# Altium schematic sheet Codec.SchDoc
size A3; SheetNumber: 8; SheetTotal: 13
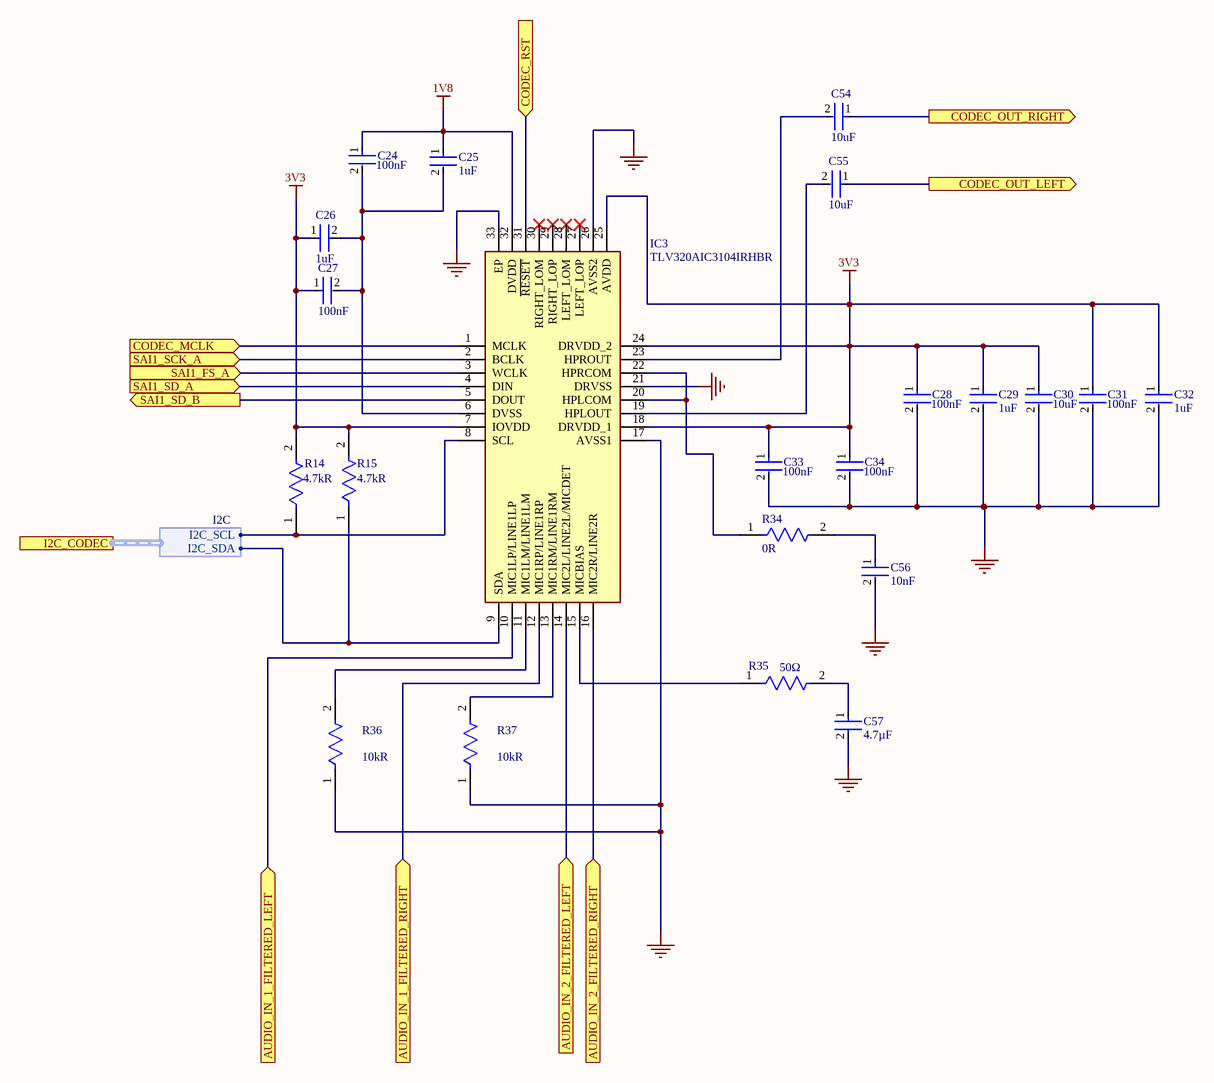
[diagram p0: Codec.SchDoc]

## Parts
C24  Capacitance: 100nF  [FP-GRM033-0_03-IPC_C]  (hidden comment: GRM033C71C104ME14J)
C25  Capacitance: 1uF  [FP-GRM155-0_1-IPC_B]  (hidden comment: GRM155C70J105ME11J)
C26  Capacitance: 1uF  [FP-GRM155-0_1-IPC_B]  (hidden comment: GRM155C70J105ME11J)
C27  Capacitance: 100nF  [FP-GRM033-0_03-IPC_C]  (hidden comment: GRM033C71C104ME14J)
C28  Capacitance: 100nF  [FP-GRM033-0_03-IPC_C]  (hidden comment: GRM033C71C104ME14J)
C29  Capacitance: 1uF  [FP-GRM155-0_1-IPC_B]  (hidden comment: GRM155C70J105ME11J)
C30  Capacitance: 10uF  [FP-GRM21B-0_15-IPC_C]  (hidden comment: GRM21BC81E106KE51K)
C31  Capacitance: 100nF  [FP-GRM033-0_03-IPC_C]  (hidden comment: GRM033C71C104ME14J)
C32  Capacitance: 1uF  [FP-GRM155-0_1-IPC_B]  (hidden comment: GRM155C70J105ME11J)
C33  Capacitance: 100nF  [FP-GRM033-0_03-IPC_C]  (hidden comment: GRM033C71C104ME14J)
C34  Capacitance: 100nF  [FP-GRM033-0_03-IPC_C]  (hidden comment: GRM033C71C104ME14J)
C54  Capacitance: 10uF  [FP-GRM21B-0_15-IPC_C]  (hidden comment: GRM21BC81E106KE51K)
C55  Capacitance: 10uF  [FP-GRM21B-0_15-IPC_C]  (hidden comment: GRM21BC81E106KE51K)
C56  Capacitance: 10nF  [FP-GCM155-0_05-MFG]  (hidden comment: GCM155R71H103KA55W)
C57  Capacitance: 4.7µF  [FP-GCM155-0_2-MFG]  (hidden comment: GCM155D70G475ME36D)
IC3  TLV320AIC3104IRHBR  [TLV320AIC3104IRHBR]
R14  Resistance: 4.7kR  [FP-RC1005-IPC_C]  (hidden comment: RC1005J472CS)
R15  Resistance: 4.7kR  [FP-RC1005-IPC_C]  (hidden comment: RC1005J472CS)
R34  Resistance: 0R  [FP-RMCF0402-MFG]  (hidden comment: RMCF0402ZT0R00)
R35  Resistance: 50Ω  [FP-RC0402-0_4-MFG]  (hidden comment: RC0402JR-0750RL)
R36  Resistance: 10kR  [FP-RC0402-0_4-IPC_A]  (hidden comment: RC0402FR-1310KL)
R37  Resistance: 10kR  [FP-RC0402-0_4-IPC_A]  (hidden comment: RC0402FR-1310KL)

## Ports
AUDIO_IN_1_FILTERED_LEFT (in, see high_level[6B], Input_Output_Filtering[6B]), AUDIO_IN_1_FILTERED_RIGHT (in, see high_level[6B], Input_Output_Filtering[6C]), AUDIO_IN_2_FILTERED_LEFT (in, see high_level[6B], Input_Output_Filtering[6A]), AUDIO_IN_2_FILTERED_RIGHT (in, see high_level[6B], Input_Output_Filtering[6B]), CODEC_MCLK (in, see high_level[5A], MCU_Connections[5B]), CODEC_OUT_LEFT (out, see high_level[6B], Input_Output_Filtering[3C]), CODEC_OUT_RIGHT (out, see high_level[6B], Input_Output_Filtering[3D]), CODEC_RST (in, see high_level[5A], MCU_Connections[5B]), I2C_CODEC (harness I2C, see high_level[5A], MCU_Connections[5B]), SAI1_FS_A (in, see high_level[5A], MCU_Connections[5B]), SAI1_SCK_A (in, see high_level[5A], MCU_Connections[5B]), SAI1_SD_A (in, see high_level[5A], MCU_Connections[5B]), SAI1_SD_B (out, see high_level[5A], MCU_Connections[5B])

## Harnesses
I2C: I2C_SCL, I2C_SDA

## Nets
1V8: C24.1 C25.1 IC3.32(DVDD)
3V3: C26.1 C27.1 C28.1 C29.1 C30.1 C31.1 C32.1 C33.1 C34.1 IC3.7(IOVDD) IC3.18(DRVDD_1) IC3.24(DRVDD_2) IC3.25(AVDD) R14.2 R15.2
GND: C28.2 C29.2 C30.2 C31.2 C32.2 C33.2 C34.2 C56.2 C57.2 IC3.17(AVSS1) IC3.21(DRVSS) IC3.26(AVSS2) IC3.33(EP) R36.1 R37.1
AUDIO_IN_1_FILTERED_LEFT: IC3.10(MIC1LP/LINE1LP) ; port AUDIO_IN_1_FILTERED_LEFT
AUDIO_IN_1_FILTERED_RIGHT: IC3.12(MIC1RP/LINE1RP) ; port AUDIO_IN_1_FILTERED_RIGHT
AUDIO_IN_2_FILTERED_LEFT: IC3.14(MIC2L/LINE2L/MICDET) ; port AUDIO_IN_2_FILTERED_LEFT
AUDIO_IN_2_FILTERED_RIGHT: IC3.16(MIC2R/LINE2R) ; port AUDIO_IN_2_FILTERED_RIGHT
CODEC_MCLK: IC3.1(MCLK) ; port CODEC_MCLK
CODEC_OUT_LEFT: C55.1 ; port CODEC_OUT_LEFT
CODEC_OUT_RIGHT: C54.1 ; port CODEC_OUT_RIGHT
CODEC_RST: IC3.31(~{RESET}) ; port CODEC_RST
SAI1_FS_A: IC3.3(WCLK) ; port SAI1_FS_A
SAI1_SCK_A: IC3.2(BCLK) ; port SAI1_SCK_A
SAI1_SD_A: IC3.4(DIN) ; port SAI1_SD_A
SAI1_SD_B: IC3.5(DOUT) ; port SAI1_SD_B
NetC24_2: C24.2 C25.2 C26.2 C27.2 IC3.6(DVSS)
NetC54_2: C54.2 IC3.23(HPROUT)
NetC55_2: C55.2 IC3.19(HPLOUT)
NetC56_1: C56.1 R34.2
NetC57_1: C57.1 R35.2
NetIC3_8: IC3.8(SCL) R14.1 ; port I2C_CODEC.I2C_SCL
NetIC3_9: IC3.9(SDA) R15.1 ; port I2C_CODEC.I2C_SDA
NetIC3_11: IC3.11(MIC1LM/LINE1LM) R36.2
NetIC3_13: IC3.13(MIC1RM/LINE1RM) R37.2
NetIC3_15: IC3.15(MICBIAS) R35.1
NetIC3_20: IC3.20(HPLCOM) IC3.22(HPRCOM) R34.1

Not connected (* = marked no-connect by the designer): IC3 27(LEFT_LOP)* 28(LEFT_LOM)* 29(RIGHT_LOP)* 30(RIGHT_LOM)*

## Library data of the parts
C24 C27 C28 C31 C33 C34 = CMP-06035-001619-1: Chip Multilayer Ceramic Capacitors for General Purpose, 0201, 0.10uF, X7S, 22%, 20%, 16V; Dielectric: X7S; Tolerance: 20%; Length: 600um; Width: 300um; Voltage Rating (DC): 16V; Thickness: 300um
C25 C26 C29 C32 = CMP-06035-036014-1: Chip Multilayer Ceramic Capacitors for General Purpose, 0402, 1.0uF, X7S, 22%, 20%, 6.3V; Tolerance: 20%; Dielectric: X7S; Length: 1mm; Voltage Rating (DC): 6.3V; Thickness: 500um; Width: 500um
C30 C54 C55 = CMP-06035-031044-1: Chip Multilayer Ceramic Capacitors for General Purpose, 0805, 10uF, X6S, 22%, 10%, 25V; Case/Package: 0805; Length: 2mm; Dielectric: X6S; Voltage Rating (DC): 25V; Thickness: 1.25mm; Width: 1.25mm; Tolerance: 10%
C56 = CMP-06035-055122-1: Ceramic Capacitor for Automotive 10nF ±10% 50VDC X7R 0402 Paper T/R
C57 = CMP-00260-135863758-1: GCM155D70G475ME36D AC 2C 216S Skt Recp; Tolerance: 20%; Voltage Rating: 4V; Material: Ceramic; Lifecycle Status: Production; Height: 700µm; Min Operating Temperature: -55°C; NexarPartId: 135863758; Max Operating Temperature: 125°C; Case/Package: 0402
IC3 = TLV320AIC3104IRHBR: Integrated Circuit; Manufacturer_Name: Texas Instruments; Datasheet Link: http://www.ti.com/lit/ds/symlink/tlv320aic3104.pdf; Height: 1mm; Manufacturer_Part_Number: TLV320AIC3104IRHBR; Mouser Part Number: 595-TLV320C3104IRHBR; Mouser Price/Stock: https://www.mouser.co.uk/ProductDetail/Texas-Instruments/TLV320AIC3104IRHBR?qs=t6sYTo5dwUzbYVbTYmm%2FAg%3D%3D; Arrow Part Number: TLV320AIC3104IRHBR; Arrow Price/Stock: https://www.arrow.com/en/products/tlv320aic3104irhbr/texas-instruments?utm_currency=USD&region=nac
R14 R15 = CMP-13261-005440-1: Res Thick Film 0402 4.7kΩ 5% 0.063W ±100ppm/°C Molded SMD T/R; Power Rating: 63mW; Voltage Rating (DC): 50V; Depth: 0.5mm; Length: 1mm; Package Quantity: 1; Composition: Thick Film; Temperature Coefficient: 100ppm/°C; Case Code (Metric): 1005; Mount: Surface Mount; Lead Free: Lead Free; Features: Moisture Resistant; Max Power Dissipation: 63mW; Tolerance: 5%; Height: 0.016inch; Case Code (Imperial): 0402; Packaging: Tape and Reel; Min Operating Temperature: -55°C; Radiation Hardening: No; Contact Plating: Tin; Case/Package: 0402; Width: 0.02inch; Military Standard: Not; Max Operating Temperature: 125°C; Number of Terminations: 2
R34 = CMP-26527-007617-1: RES 0 OHM JUMPER 1/16W 0402; Power Rating: 63mW; Working Voltage: 50V; Current Rating: 1A; Series: RMCF; RoHS Compliant: Yes; Features: Automotive AEC-Q200; Width: 0.02inch; Depth: 0.5mm; Resistor Type: Thick Film; Number of Terminations: 2; Radiation Hardening: No; Length: 0.039inch; Contact Plating: Tin; Case/Package: 0402; Min Operating Temperature: -55°C; Case Code (Metric): 1005; Construction: Rectangular; Mount: Surface Mount; Max Operating Temperature: 155°C; Max Power Dissipation: 63mW; Height: 0.016inch; Lead Free: Lead Free; Packaging: Tape and Reel; Technology: THICK FILM; Case Code (Imperial): 0402; Military Standard: Not
R35 = CMP-00621-24490980-1: RC0402JR-0750RL SMD Chip Resistor, 50 Ohm, ± 5%, 63 mW, 0402 [1005 Metric], Thick Film, General Purpose; Temperature Coefficient: 100ppm/°C; Max Power Dissipation: 63mW; Width: 508µm; RoHS: Compliant; Height: 406.4µm; Length: 990.6µm; Features: Moisture Resistant; Tolerance: 5%; Lead Free: Lead Free; Case/Package: 0402; NexarPartId: 24490980; Min Operating Temperature: -55°C; Composition: Thick Film; Packaging: Tape & Reel (TR); Schedule B: 8533210045, 8533210045; Number of Terminations: 2; Max Operating Temperature: 155°C
R36 R37 = CMP-2002-07854-2: RESISTOR 0402 10K 1%; Power Rating: 62.5mW; Voltage Rating (DC): 50V; Temperature Coefficient: 100ppm/°C; REACH SVHC: No SVHC; Case/Package: 0402; Termination: SMD/SMT; Max Operating Temperature: 155°C; Contact Plating: Tin; Resistance Tolerance: 1%; Radiation Hardening: No; Voltage Rating: 50V; Lead Free: Lead Free; Length: 1mm; Depth: 0.5mm; Number of Pins: 2; RoHS Compliant: Yes; Case Code (Imperial): 0402; Case Code (Metric): 1005; Min Operating Temperature: -55°C; Packaging: Tape and Reel; Technology: THICK FILM; Series: RC; Number of Terminations: 2; Resistor Type: Thick Film; Tolerance: 1%; Working Voltage: 50V; Military Standard: Not; Construction: Rectangular